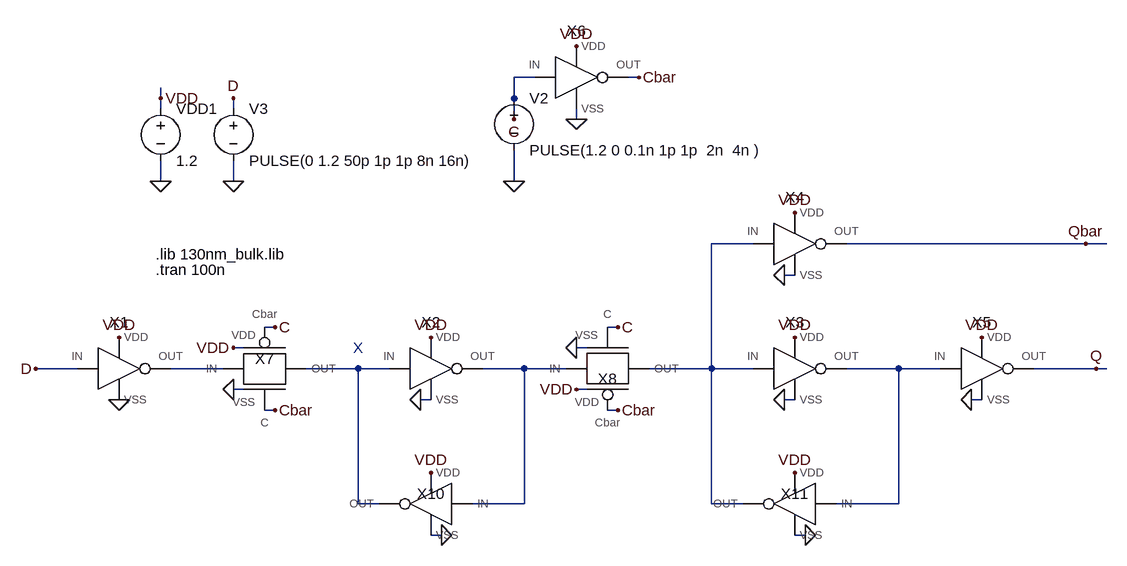
[diagram p0: schematic Prob3.asc]
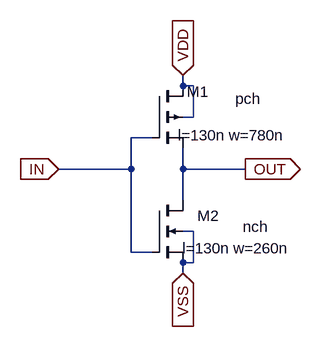
[diagram p1: sub-circuit inverter1.asc]
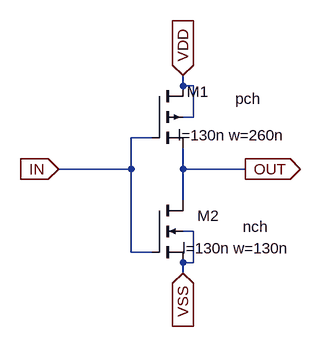
[diagram p2: sub-circuit inverter2.asc]
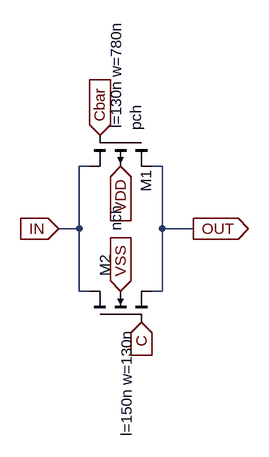
[diagram p3: sub-circuit tg.asc]
Prob3.asc, the LTspice schematic file:
Version 4.1
SHEET 1 1308 784
WIRE 400 -272 368 -272
WIRE 560 -272 544 -272
WIRE -176 -240 -176 -256
WIRE 368 -240 368 -272
WIRE -176 -224 -176 -240
WIRE -64 -224 -64 -240
WIRE 368 -208 368 -240
WIRE 464 -208 464 -224
WIRE -176 -112 -176 -144
WIRE -64 -112 -64 -144
WIRE 368 -112 368 -160
WIRE 736 -16 672 -16
WIRE 1248 -16 880 -16
WIRE 1280 -16 1248 -16
WIRE 800 32 784 32
WIRE 0 112 -16 112
WIRE 528 112 512 112
WIRE -48 144 -64 144
WIRE 480 144 464 144
WIRE -304 176 -368 176
WIRE -80 176 -160 176
WIRE 128 176 48 176
WIRE 176 176 128 176
WIRE 384 176 320 176
WIRE 448 176 384 176
WIRE 672 176 672 -16
WIRE 672 176 576 176
WIRE 736 176 672 176
WIRE 960 176 880 176
WIRE 1024 176 960 176
WIRE 1264 176 1168 176
WIRE 1280 176 1264 176
WIRE -48 208 -64 208
WIRE 480 208 464 208
WIRE 240 224 224 224
WIRE 800 224 784 224
WIRE 1088 224 1072 224
WIRE 0 240 -16 240
WIRE 528 240 512 240
WIRE 128 384 128 176
WIRE 160 384 128 384
WIRE 384 384 384 176
WIRE 384 384 304 384
WIRE 672 384 672 176
WIRE 720 384 672 384
WIRE 960 384 960 176
WIRE 960 384 864 384
WIRE 256 432 240 432
WIRE 816 432 800 432
FLAG 1248 -16 Qbar
FLAG 1264 176 Q
FLAG -64 -112 0
FLAG -64 -240 D
FLAG 368 -112 0
FLAG 368 -208 C
FLAG 560 -272 Cbar
FLAG -240 224 0
FLAG 224 224 0
FLAG 256 432 0
FLAG 784 224 0
FLAG 1072 224 0
FLAG 784 32 0
FLAG 816 432 0
FLAG -176 -112 0
FLAG -176 -240 VDD
FLAG -240 128 VDD
FLAG 240 128 VDD
FLAG 240 336 VDD
FLAG 1088 128 VDD
FLAG 800 -64 VDD
FLAG 800 128 VDD
FLAG 800 336 VDD
FLAG -368 176 D
FLAG 0 112 C
FLAG 464 -208 0
FLAG 464 -320 VDD
FLAG -64 144 VDD
FLAG 0 240 Cbar
FLAG -64 208 0
FLAG 464 208 VDD
FLAG 528 112 C
FLAG 528 240 Cbar
FLAG 464 144 0
SYMBOL Inverter1 -240 176 R0
SYMATTR InstName X1
SYMBOL Inverter1 240 176 R0
SYMATTR InstName X2
SYMBOL Inverter1 800 176 R0
SYMATTR InstName X3
SYMBOL Inverter1 800 -16 R0
SYMATTR InstName X4
SYMBOL Inverter1 1088 176 R0
SYMATTR InstName X5
SYMBOL voltage 368 -256 R0
WINDOW 123 0 0 Left 0
WINDOW 39 0 0 Left 0
SYMATTR InstName V2
SYMATTR Value PULSE(1.2 0 0.1n 1p 1p  2n  4n )
SYMBOL voltage -64 -240 R0
WINDOW 123 0 0 Left 0
WINDOW 39 0 0 Left 0
SYMATTR InstName V3
SYMATTR Value PULSE(0 1.2 50p 1p 1p 8n 16n)
SYMBOL voltage -176 -240 R0
WINDOW 123 0 0 Left 2
WINDOW 39 0 0 Left 2
SYMATTR InstName VDD1
SYMATTR Value 1.2
SYMBOL Inverter2 240 384 M0
SYMATTR InstName X10
SYMBOL Inverter2 800 384 M0
SYMATTR InstName X11
SYMBOL Inverter1 464 -272 R0
SYMATTR InstName X6
SYMBOL TG -16 176 R0
SYMATTR InstName X7
SYMBOL TG 512 176 M180
SYMATTR InstName X8
TEXT -184 0 Left 2 !.lib 130nm_bulk.lib
TEXT -184 24 Left 2 !.tran 100n
TEXT 120 144 Left 2 ;X

inverter1.asc, the sub-circuit schematic file:
Version 4.1
SHEET 1 880 680
WIRE 176 32 176 16
WIRE 192 32 176 32
WIRE 192 80 192 32
WIRE 192 80 176 80
WIRE 128 112 96 112
WIRE 96 160 96 112
WIRE 96 160 -16 160
WIRE 176 160 176 128
WIRE 272 160 176 160
WIRE 176 208 176 160
WIRE 192 256 176 256
WIRE 96 288 96 160
WIRE 128 288 96 288
WIRE 192 304 192 256
WIRE 192 304 176 304
WIRE 176 320 176 304
FLAG -16 160 IN
IOPIN -16 160 In
FLAG 176 16 VDD
IOPIN 176 16 In
FLAG 176 320 VSS
IOPIN 176 320 In
FLAG 272 160 OUT
IOPIN 272 160 Out
SYMBOL pmos4 128 32 R0
WINDOW 0 88 9 Right 2
WINDOW 3 168 20 Right 2
WINDOW 123 206 76 Right 2
SYMATTR InstName M1
SYMATTR Value pch
SYMATTR Value2 l=130n w=780n
SYMBOL nmos4 128 208 R0
WINDOW 0 104 24 Right 2
WINDOW 3 179 41 Right 2
WINDOW 123 213 74 Right 2
SYMATTR InstName M2
SYMATTR Value nch
SYMATTR Value2 l=130n w=260n

inverter2.asc, the sub-circuit schematic file:
Version 4.1
SHEET 1 880 680
WIRE 160 -64 160 -80
WIRE 176 -64 160 -64
WIRE 176 -16 176 -64
WIRE 176 -16 160 -16
WIRE 112 16 80 16
WIRE 80 64 80 16
WIRE 80 64 -32 64
WIRE 160 64 160 32
WIRE 256 64 160 64
WIRE 160 112 160 64
WIRE 176 160 160 160
WIRE 80 192 80 64
WIRE 112 192 80 192
WIRE 176 208 176 160
WIRE 176 208 160 208
WIRE 160 224 160 208
FLAG -32 64 IN
IOPIN -32 64 In
FLAG 160 -80 VDD
IOPIN 160 -80 In
FLAG 160 224 VSS
IOPIN 160 224 In
FLAG 256 64 OUT
IOPIN 256 64 Out
SYMBOL pmos4 112 -64 R0
WINDOW 0 88 9 Right 2
WINDOW 3 168 20 Right 2
WINDOW 123 206 76 Right 2
SYMATTR InstName M1
SYMATTR Value pch
SYMATTR Value2 l=130n w=260n
SYMBOL nmos4 112 112 R0
WINDOW 0 104 24 Right 2
WINDOW 3 179 41 Right 2
WINDOW 123 213 74 Right 2
SYMATTR InstName M2
SYMATTR Value nch
SYMATTR Value2 l=130n w=130n

tg.asc, the sub-circuit schematic file:
Version 4.1
SHEET 1 2188 680
WIRE 1920 -128 1904 -128
WIRE 2032 -128 2016 -128
WIRE 1904 -32 1904 -128
WIRE 1904 -32 1872 -32
WIRE 2032 -32 2032 -128
WIRE 2080 -32 2032 -32
WIRE 1904 64 1904 -32
WIRE 1920 64 1904 64
WIRE 2032 64 2032 -32
WIRE 2032 64 2016 64
FLAG 1936 -176 Cbar
IOPIN 1936 -176 In
FLAG 2000 112 C
IOPIN 2000 112 In
FLAG 1872 -32 IN
IOPIN 1872 -32 In
FLAG 2080 -32 OUT
IOPIN 2080 -32 Out
FLAG 1968 -128 VDD
IOPIN 1968 -128 In
FLAG 1968 64 VSS
IOPIN 1968 64 In
SYMBOL pmos4 2016 -176 R90
WINDOW 0 88 9 Right 2
WINDOW 3 -7 24 Right 2
WINDOW 123 -10 55 Right 2
SYMATTR InstName M1
SYMATTR Value pch
SYMATTR Value2 l=130n w=780n
SYMBOL nmos4 1920 112 R270
WINDOW 0 104 24 Right 2
WINDOW 3 179 41 Right 2
WINDOW 123 -10 57 Right 2
SYMATTR InstName M2
SYMATTR Value nch
SYMATTR Value2 l=150n w=130n

The netlist it stands for:
* Prob3.asc
X§X1 D VDD 0 N002 inverter1
X§X2 N003 VDD 0 N004 inverter1
X§X3 N001 VDD 0 N005 inverter1
X§X4 N001 VDD 0 Qbar inverter1
X§X5 N005 VDD 0 Q inverter1
V2 C 0 PULSE(1.2 0 0.1n 1p 1p  2n  4n )
V3 D 0 PULSE(0 1.2 50p 1p 1p 8n 16n)
VDD1 VDD 0 1.2
X§X10 N004 VDD 0 N003 inverter2
X§X11 N005 VDD 0 N001 inverter2
X§X6 C VDD 0 Cbar inverter1
X§X7 Cbar C N002 VDD 0 N003 tg
X§X8 C Cbar N004 VDD 0 N001 tg

* block symbol definitions
.subckt inverter1 IN VDD VSS OUT
M1 VDD IN OUT VDD pch l=130n w=780n
M2 OUT IN VSS VSS nch l=130n w=260n
.ends inverter1

.subckt inverter2 IN VDD VSS OUT
M1 VDD IN OUT VDD pch l=130n w=260n
M2 OUT IN VSS VSS nch l=130n w=130n
.ends inverter2

.subckt tg C Cbar IN VDD VSS OUT
M1 OUT Cbar IN VDD pch l=130n w=780n
M2 IN C OUT VSS nch l=150n w=130n
.ends tg

.model NMOS NMOS
.model PMOS PMOS
.lib standard.mos
.lib 130nm_bulk.lib
.tran 100n
* X
.backanno
.end